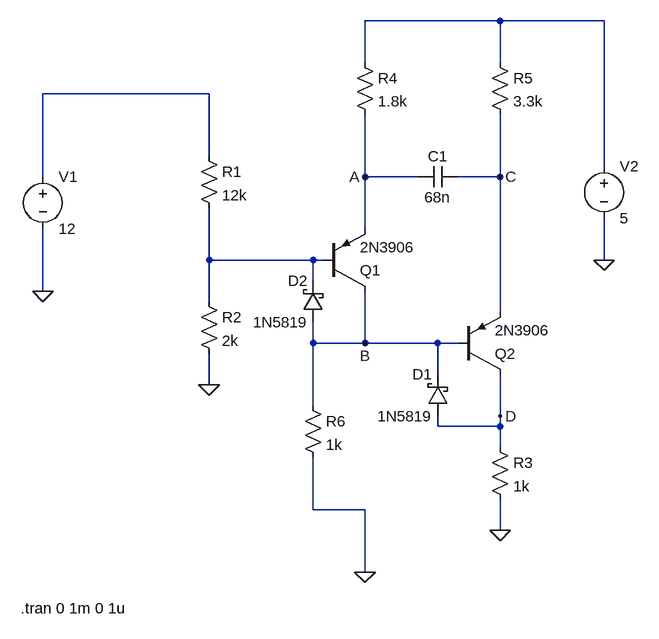
[diagram p0: schematic vco2.asc]
vco2.asc, the LTspice schematic file:
Version 4
SHEET 1 880 680
WIRE 176 -304 -32 -304
WIRE 336 -304 176 -304
WIRE -32 -240 -32 -304
WIRE 176 -240 176 -304
WIRE -272 -192 -528 -192
WIRE -272 -96 -272 -192
WIRE 336 -80 336 -304
WIRE -528 -64 -528 -192
WIRE -32 -64 -32 -160
WIRE 48 -64 -32 -64
WIRE 176 -64 176 -160
WIRE 176 -64 112 -64
WIRE -32 16 -32 -64
WIRE -272 64 -272 -16
WIRE -112 64 -272 64
WIRE -96 64 -112 64
WIRE 336 64 336 0
WIRE -112 96 -112 64
WIRE -528 112 -528 16
WIRE -272 128 -272 64
WIRE 176 144 176 -64
WIRE -112 192 -112 160
WIRE -32 192 -32 112
WIRE -32 192 -112 192
WIRE 80 192 -32 192
WIRE 112 192 80 192
WIRE 80 240 80 192
WIRE -272 256 -272 208
WIRE -112 288 -112 192
WIRE 176 304 176 240
WIRE 80 320 80 304
WIRE 176 320 176 304
WIRE 176 320 80 320
WIRE 176 352 176 320
WIRE -112 448 -112 368
WIRE -32 448 -112 448
WIRE 176 480 176 432
WIRE -32 544 -32 448
FLAG -272 256 0
FLAG 176 480 0
FLAG -528 112 0
FLAG 336 64 0
FLAG -32 544 0
FLAG -32 -64 A
FLAG -32 192 B
FLAG 176 -64 C
FLAG 176 304 D
SYMBOL res -288 -112 R0
SYMATTR InstName R1
SYMATTR Value 12k
SYMBOL res -288 112 R0
SYMATTR InstName R2
SYMATTR Value 2k
SYMBOL pnp -96 112 M180
SYMATTR InstName Q1
SYMATTR Value 2N3906
SYMBOL pnp 112 240 M180
SYMATTR InstName Q2
SYMATTR Value 2N3906
SYMBOL res 160 336 R0
SYMATTR InstName R3
SYMATTR Value 1k
SYMBOL res -48 -256 R0
SYMATTR InstName R4
SYMATTR Value 1.8k
SYMBOL res 160 -256 R0
SYMATTR InstName R5
SYMATTR Value 3.3k
SYMBOL cap 112 -80 R90
WINDOW 0 0 32 VBottom 2
WINDOW 3 32 32 VTop 2
SYMATTR InstName C1
SYMATTR Value 68n
SYMBOL res -128 272 R0
SYMATTR InstName R6
SYMATTR Value 1k
SYMBOL voltage -528 -80 R0
WINDOW 123 0 0 Left 2
WINDOW 39 0 0 Left 2
SYMATTR InstName V1
SYMATTR Value 12
SYMBOL voltage 336 -96 R0
WINDOW 123 0 0 Left 2
WINDOW 39 0 0 Left 2
SYMATTR InstName V2
SYMATTR Value 5
SYMBOL schottky 96 304 R180
WINDOW 0 24 64 Left 2
WINDOW 3 24 0 Left 2
SYMATTR InstName D1
SYMATTR Value 1N5819
SYMATTR Description Diode
SYMATTR Type diode
SYMBOL schottky -96 160 R180
WINDOW 0 24 64 Left 2
WINDOW 3 24 0 Left 2
SYMATTR InstName D2
SYMATTR Value 1N5819
SYMATTR Description Diode
SYMATTR Type diode
TEXT -562 600 Left 2 !.tran 0 1m 0 1u

The netlist it stands for:
* vco2.asc
R1 N002 N003 12k
R2 N003 0 2k
Q1 B N003 A 0 2N3906
Q2 D B C 0 2N3906
R3 D 0 1k
R4 N001 A 1.8k
R5 N001 C 3.3k
C1 C A 68n
R6 B 0 1k
V1 N002 0 12
V2 N001 0 5
D1 D B 1N5819
D2 B N003 1N5819
.model D D
.lib standard.dio
.model NPN NPN
.model PNP PNP
.lib standard.bjt
.tran 0 1m 0 1u
.backanno
.end